# EAGLE design charliewatch-0402 (EAGLE 7.7.0)
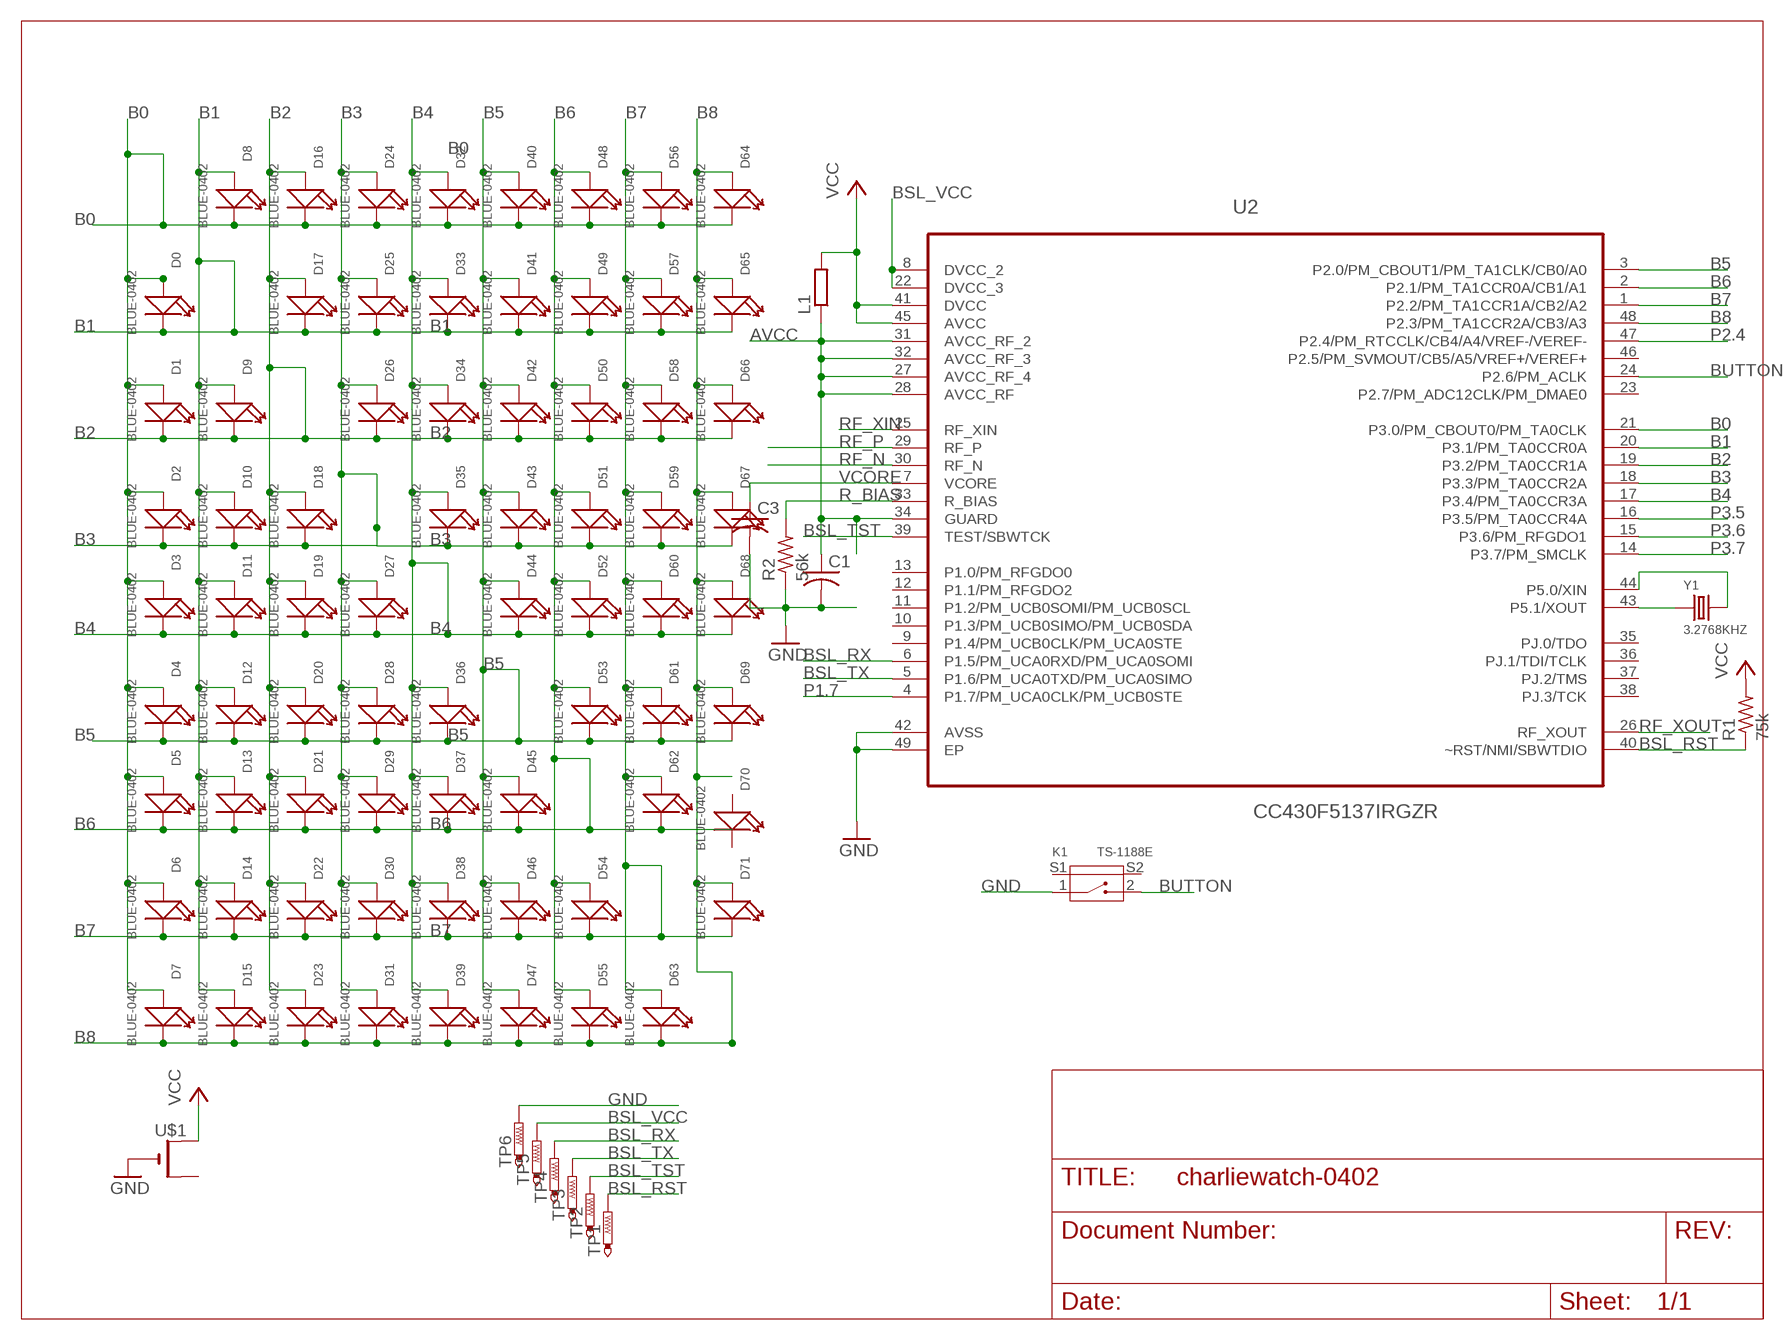
[diagram p0: schematic, sheet 1]

## Parts
C1  C-USC0402  [C0402]
C3  C-USC0402  [C0402]
D0  BLUE-0402  SMD-LED-CLEAR-BLUE(0402)  [LED-0402]
D1  BLUE-0402  SMD-LED-CLEAR-BLUE(0402)  [LED-0402]
D2  BLUE-0402  SMD-LED-CLEAR-BLUE(0402)  [LED-0402]
D3  BLUE-0402  SMD-LED-CLEAR-BLUE(0402)  [LED-0402]
D4  BLUE-0402  SMD-LED-CLEAR-BLUE(0402)  [LED-0402]
D5  BLUE-0402  SMD-LED-CLEAR-BLUE(0402)  [LED-0402]
D6  BLUE-0402  SMD-LED-CLEAR-BLUE(0402)  [LED-0402]
D7  BLUE-0402  SMD-LED-CLEAR-BLUE(0402)  [LED-0402]
D8  BLUE-0402  SMD-LED-CLEAR-BLUE(0402)  [LED-0402]
D9  BLUE-0402  SMD-LED-CLEAR-BLUE(0402)  [LED-0402]
D10  BLUE-0402  SMD-LED-CLEAR-BLUE(0402)  [LED-0402]
D11  BLUE-0402  SMD-LED-CLEAR-BLUE(0402)  [LED-0402]
D12  BLUE-0402  SMD-LED-CLEAR-BLUE(0402)  [LED-0402]
D13  BLUE-0402  SMD-LED-CLEAR-BLUE(0402)  [LED-0402]
D14  BLUE-0402  SMD-LED-CLEAR-BLUE(0402)  [LED-0402]
D15  BLUE-0402  SMD-LED-CLEAR-BLUE(0402)  [LED-0402]
D16  BLUE-0402  SMD-LED-CLEAR-BLUE(0402)  [LED-0402]
D17  BLUE-0402  SMD-LED-CLEAR-BLUE(0402)  [LED-0402]
D18  BLUE-0402  SMD-LED-CLEAR-BLUE(0402)  [LED-0402]
D19  BLUE-0402  SMD-LED-CLEAR-BLUE(0402)  [LED-0402]
D20  BLUE-0402  SMD-LED-CLEAR-BLUE(0402)  [LED-0402]
D21  BLUE-0402  SMD-LED-CLEAR-BLUE(0402)  [LED-0402]
D22  BLUE-0402  SMD-LED-CLEAR-BLUE(0402)  [LED-0402]
D23  BLUE-0402  SMD-LED-CLEAR-BLUE(0402)  [LED-0402]
D24  BLUE-0402  SMD-LED-CLEAR-BLUE(0402)  [LED-0402]
D25  BLUE-0402  SMD-LED-CLEAR-BLUE(0402)  [LED-0402]
D26  BLUE-0402  SMD-LED-CLEAR-BLUE(0402)  [LED-0402]
D27  BLUE-0402  SMD-LED-CLEAR-BLUE(0402)  [LED-0402]
D28  BLUE-0402  SMD-LED-CLEAR-BLUE(0402)  [LED-0402]
D29  BLUE-0402  SMD-LED-CLEAR-BLUE(0402)  [LED-0402]
D30  BLUE-0402  SMD-LED-CLEAR-BLUE(0402)  [LED-0402]
D31  BLUE-0402  SMD-LED-CLEAR-BLUE(0402)  [LED-0402]
D32  BLUE-0402  SMD-LED-CLEAR-BLUE(0402)  [LED-0402]
D33  BLUE-0402  SMD-LED-CLEAR-BLUE(0402)  [LED-0402]
D34  BLUE-0402  SMD-LED-CLEAR-BLUE(0402)  [LED-0402]
D35  BLUE-0402  SMD-LED-CLEAR-BLUE(0402)  [LED-0402]
D36  BLUE-0402  SMD-LED-CLEAR-BLUE(0402)  [LED-0402]
D37  BLUE-0402  SMD-LED-CLEAR-BLUE(0402)  [LED-0402]
D38  BLUE-0402  SMD-LED-CLEAR-BLUE(0402)  [LED-0402]
D39  BLUE-0402  SMD-LED-CLEAR-BLUE(0402)  [LED-0402]
D40  BLUE-0402  SMD-LED-CLEAR-BLUE(0402)  [LED-0402]
D41  BLUE-0402  SMD-LED-CLEAR-BLUE(0402)  [LED-0402]
D42  BLUE-0402  SMD-LED-CLEAR-BLUE(0402)  [LED-0402]
D43  BLUE-0402  SMD-LED-CLEAR-BLUE(0402)  [LED-0402]
D44  BLUE-0402  SMD-LED-CLEAR-BLUE(0402)  [LED-0402]
D45  BLUE-0402  SMD-LED-CLEAR-BLUE(0402)  [LED-0402]
D46  BLUE-0402  SMD-LED-CLEAR-BLUE(0402)  [LED-0402]
D47  BLUE-0402  SMD-LED-CLEAR-BLUE(0402)  [LED-0402]
D48  BLUE-0402  SMD-LED-CLEAR-BLUE(0402)  [LED-0402]
D49  BLUE-0402  SMD-LED-CLEAR-BLUE(0402)  [LED-0402]
D50  BLUE-0402  SMD-LED-CLEAR-BLUE(0402)  [LED-0402]
D51  BLUE-0402  SMD-LED-CLEAR-BLUE(0402)  [LED-0402]
D52  BLUE-0402  SMD-LED-CLEAR-BLUE(0402)  [LED-0402]
D53  BLUE-0402  SMD-LED-CLEAR-BLUE(0402)  [LED-0402]
D54  BLUE-0402  SMD-LED-CLEAR-BLUE(0402)  [LED-0402]
D55  BLUE-0402  SMD-LED-CLEAR-BLUE(0402)  [LED-0402]
D56  BLUE-0402  SMD-LED-CLEAR-BLUE(0402)  [LED-0402]
D57  BLUE-0402  SMD-LED-CLEAR-BLUE(0402)  [LED-0402]
D58  BLUE-0402  SMD-LED-CLEAR-BLUE(0402)  [LED-0402]
D59  BLUE-0402  SMD-LED-CLEAR-BLUE(0402)  [LED-0402]
D60  BLUE-0402  SMD-LED-CLEAR-BLUE(0402)  [LED-0402]
D61  BLUE-0402  SMD-LED-CLEAR-BLUE(0402)  [LED-0402]
D62  BLUE-0402  SMD-LED-CLEAR-BLUE(0402)  [LED-0402]
D63  BLUE-0402  SMD-LED-CLEAR-BLUE(0402)  [LED-0402]
D64  BLUE-0402  SMD-LED-CLEAR-BLUE(0402)  [LED-0402]
D65  BLUE-0402  SMD-LED-CLEAR-BLUE(0402)  [LED-0402]
D66  BLUE-0402  SMD-LED-CLEAR-BLUE(0402)  [LED-0402]
D67  BLUE-0402  SMD-LED-CLEAR-BLUE(0402)  [LED-0402]
D68  BLUE-0402  SMD-LED-CLEAR-BLUE(0402)  [LED-0402]
D69  BLUE-0402  SMD-LED-CLEAR-BLUE(0402)  [LED-0402]
D70  BLUE-0402  SMD-LED-CLEAR-BLUE(0402)  [LED-0402]
D71  BLUE-0402  SMD-LED-CLEAR-BLUE(0402)  [LED-0402]
K1  TS-1188E  SMD-BUTTON(2+2P-7X3.5MM-90D)  [SW4-SMD-7.0X3.5X3.5MM-90D]
L1  R-EU_R0603  [R0603]
R1  75k  R-US_R0402  [R0402]
R2  56k  R-US_R0402  [R0402]
TP1  PTR1TP10R  [TP10R]
TP2  PTR1TP10R  [TP10R]
TP3  PTR1TP10R  [TP10R]
TP4  PTR1TP10R  [TP10R]
TP5  PTR1TP10R  [TP10R]
TP6  PTR1TP10SQ  [TP10SQ]
U2  CC430F5137IRGZR  [QFN50P700X700X100-49N]
U$1  CR2032SMT  [CR2032-SMD]
Y1  3.2768KHZ  SMD-CRYSTAL-32.768KHZ-12.5PF-20PPM-90K(2P-L2.0X1.2MM)  [X2-SMD-L2.0X1.2X0.55MM]

## Nets
AVCC: C1.1 L1.1 U2.27(AVCC_RF_4) U2.28(AVCC_RF) U2.31(AVCC_RF_2) U2.32(AVCC_RF_3) U2.34(GUARD)
B0: D0.+ D1.+ D2.+ D3.+ D4.+ D5.+ D6.+ D7.+ D8.- D16.- D24.- D32.- D40.- D48.- D56.- D64.- U2.21(P3.0/PM_CBOUT0/PM_TA0CLK)
B1: D0.- D8.+ D9.+ D10.+ D11.+ D12.+ D13.+ D14.+ D15.+ D17.- D25.- D33.- D41.- D49.- D57.- D65.- U2.20(P3.1/PM_TA0CCR0A)
B2: D1.- D9.- D16.+ D17.+ D18.+ D19.+ D20.+ D21.+ D22.+ D23.+ D26.- D34.- D42.- D50.- D58.- D66.- U2.19(P3.2/PM_TA0CCR1A)
B3: D2.- D10.- D18.- D24.+ D25.+ D26.+ D27.+ D28.+ D29.+ D30.+ D31.+ D35.- D43.- D51.- D59.- D67.- U2.18(P3.3/PM_TA0CCR2A)
B4: D3.- D11.- D19.- D27.- D32.+ D33.+ D34.+ D35.+ D36.+ D37.+ D38.+ D39.+ D44.- D52.- D60.- D68.- U2.17(P3.4/PM_TA0CCR3A)
B5: D4.- D12.- D20.- D28.- D36.- D40.+ D41.+ D42.+ D43.+ D44.+ D45.+ D46.+ D47.+ D53.- D61.- D69.- U2.3(P2.0/PM_CBOUT1/PM_TA1CLK/CB0/A0)
B6: D5.- D13.- D21.- D29.- D37.- D45.- D48.+ D49.+ D50.+ D51.+ D52.+ D53.+ D54.+ D55.+ D62.- U2.2(P2.1/PM_TA1CCR0A/CB1/A1)
B7: D6.- D14.- D22.- D30.- D38.- D46.- D54.- D56.+ D57.+ D58.+ D59.+ D60.+ D61.+ D62.+ D63.+ D71.- U2.1(P2.2/PM_TA1CCR1A/CB2/A2)
B8: D7.- D15.- D23.- D31.- D39.- D47.- D55.- D63.- D64.+ D65.+ D66.+ D67.+ D68.+ D69.+ D71.+ U2.48(P2.3/PM_TA1CCR2A/CB3/A3)
BSL_RST: R1.1 TP1.TP U2.40(~RST/NMI/SBWTDIO)
BSL_RX: TP4.TP U2.6(P1.5/PM_UCA0RXD/PM_UCA0SOMI)
BSL_TST: TP2.TP U2.39(TEST/SBWTCK)
BSL_TX: TP3.TP U2.5(P1.6/PM_UCA0TXD/PM_UCA0SIMO)
BSL_VCC: TP5.TP U2.8(DVCC_2) U2.22(DVCC_3)
BUTTON: K1.2 U2.24(P2.6/PM_ACLK)
GND: C1.2 C3.2 K1.1 R2.1 TP6.TP U2.42(AVSS) U2.49(EP) U$1.-
P1.7: U2.4(P1.7/PM_UCA0CLK/PM_UCB0STE)
P2.4: U2.47(P2.4/PM_RTCCLK/CB4/A4/VREF-/VEREF-)
P3.5: U2.16(P3.5/PM_TA0CCR4A)
P3.6: U2.15(P3.6/PM_RFGDO1)
P3.7: U2.14(P3.7/PM_SMCLK)
R_BIAS: R2.2 U2.33(R_BIAS)
RF_N: U2.30(RF_N)
RF_P: U2.29(RF_P)
RF_XIN: U2.25(RF_XIN)
RF_XOUT: U2.26(RF_XOUT)
VCC: L1.2 R1.2 U2.41(DVCC) U2.45(AVCC) U$1.+$1(+)
VCORE: C3.1 U2.7(VCORE)
XIN: U2.44(P5.0/XIN) Y1.2
XOUT: U2.43(P5.1/XOUT) Y1.1
Unconnected: D70.+ D70.- K1.S1 K1.S2 U2.9(P1.4/PM_UCB0CLK/PM_UCA0STE) U2.10(P1.3/PM_UCB0SIMO/PM_UCB0SDA) U2.11(P1.2/PM_UCB0SOMI/PM_UCB0SCL) U2.12(P1.1/PM_RFGDO2) U2.13(P1.0/PM_RFGDO0) U2.23(P2.7/PM_ADC12CLK/PM_DMAE0) U2.35(PJ.0/TDO) U2.36(PJ.1/TDI/TCLK) U2.37(PJ.2/TMS) U2.38(PJ.3/TCK) U2.46(P2.5/PM_SVMOUT/CB5/A5/VREF+/VEREF+) U$1.+$2(+1)

## Library data of the parts
C1 C3 = resistor:C-US: CAPACITOR, American symbol
D0 D1-D71 = Seeed-LED:SMD-LED-CLEAR-BLUE(0402): 304090075; MPN: BL-HB337A-AV-TRB
K1 = Seeed-Switch:SMD-BUTTON(2+2P-7X3.5MM-90D): 311020023; MPN: TS-1188E
L1 = rcl:R-EU_: RESISTOR, European symbol
R1 R2 = rcl:R-US_: RESISTOR, American symbol
TP1-TP6 = testpad:PTR1: TEST PIN
U2 = Texas Instruments_By_element14_Batch_1:CC430F5137IRGZR: MSP430 SoC with RF Core; MPN: CC430F5137IRGZR; OC_FARNELL: -; OC_NEWARK: 68R5912; PACKAGE: QFN-48; SUPPLIER: TEXAS INSTRUMENTS
U$1 = adafruit:CR2032
Y1 = Seeed-Crystal Oscillator:SMD-CRYSTAL-32.768KHZ-12.5PF-20PPM-90K(2P-L2.0X1.2MM): 306010020; MPN: FC-12M

## Net classes
0 default: width 0.102 mm, drill 0.025 mm, clearance 0.025 mm

## Board
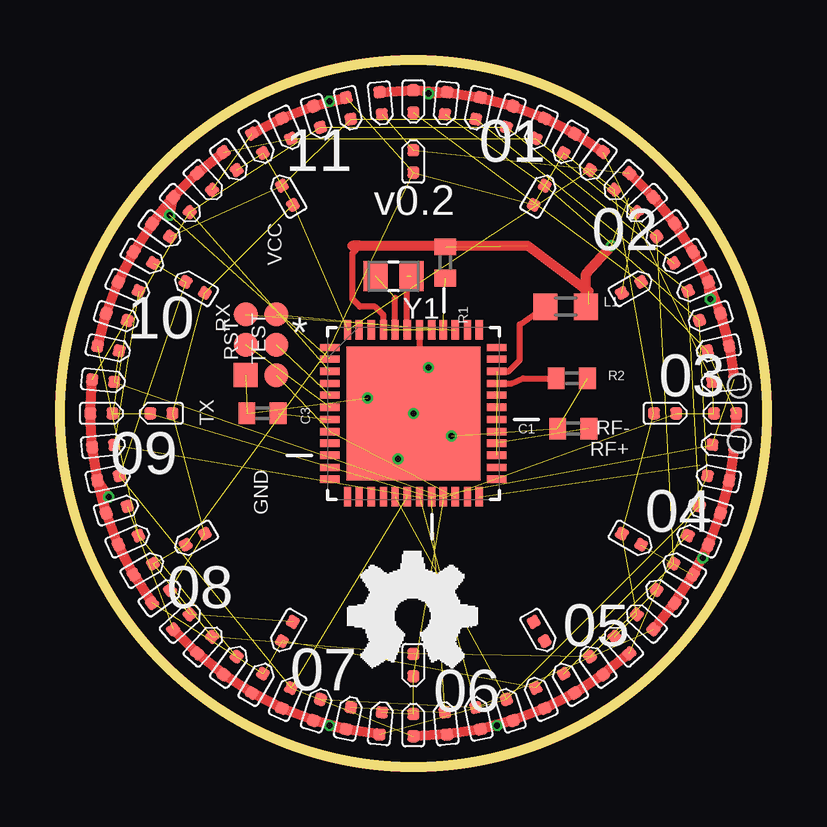
[diagram p1: board, top side]
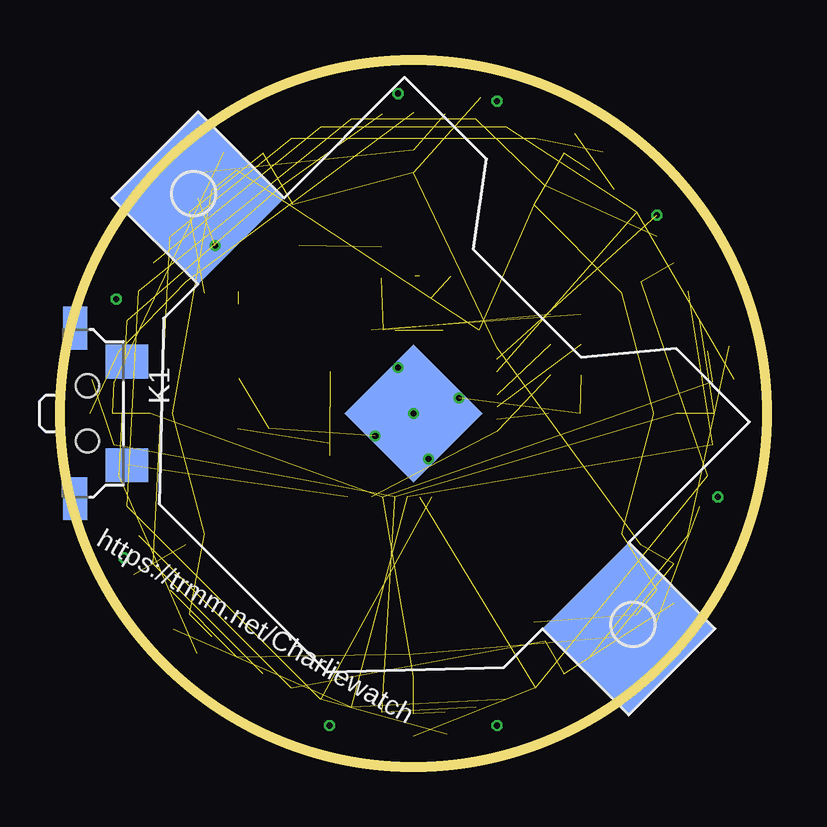
[diagram p2: board, bottom side, seen from below]

Size 29.46 x 29.46 mm. Coordinates in mm from the lower left corner, seen from the top.
Outline: circle at 14.73,14.73 radius 14.73
Copper layers (1*16): Top 0.035mm / dielectric 1.5mm / Bottom 0.035mm
Design rules "default *": minimum track width 10mil, minimum drill 10mil, track to track 5mil, track to pad 5mil, pad to pad 5mil, via to via 5mil, smd to smd 5mil, copper to edge 40mil, drill to drill 8mil, minimum pad ring 10mil, minimum via ring 4mil, stop-mask expansion 4mil, vias tented up to drill 15mil, thermal gap 10mil

### Footprints (pad centres in the part's own frame; a part is rotated, then mirrored left to right if it is on the bottom)
C0402 = smd 0.7 x 0.9: 1 -0.65,0; 2 0.65,0
LED-0402 = smd 0.5 x 0.5: + -0.463,0; - 0.463,0
SW4-SMD-7.0X3.5X3.5MM-90D = smd 1.397 x 1.778: 1 -2.159,1.651; 2 2.159,1.651 | smd 1.778 x 1.016: S1 -3.556,-0.508; S2 3.556,-0.508 | hole 0.95: -1.15,0; 1.15,0
R0603 = smd 1 x 1.1: 1 -0.85,0; 2 0.85,0
R0402 = smd 0.7 x 0.9: 1 -0.65,0; 2 0.65,0
TP10R = smd 1 x 1: TP 0,0
TP10SQ = smd 1 x 1: TP 0,0
QFN50P700X700X100-49N = smd 0.813 x 0.305: 1 -3.48,2.743; 2 -3.48,2.261; 3 -3.48,1.753; 4 -3.48,1.245; 5 -3.48,0.762; 6 -3.48,0.254; 7 -3.48,-0.254; 8 -3.48,-0.762; 9 -3.48,-1.245; 10 -3.48,-1.753; 11 -3.48,-2.261; 12 -3.48,-2.743; 25 3.48,-2.743; 26 3.48,-2.261; 27 3.48,-1.753; 28 3.48,-1.245; 29 3.48,-0.762; 30 3.48,-0.254; 31 3.48,0.254; 32 3.48,0.762; 33 3.48,1.245; 34 3.48,1.753; 35 3.48,2.261; 36 3.48,2.743 | smd 0.305 x 0.813: 13 -2.743,-3.48; 14 -2.261,-3.48; 15 -1.753,-3.48; 16 -1.245,-3.48; 17 -0.762,-3.48; 18 -0.254,-3.48; 19 0.254,-3.48; 20 0.762,-3.48; 21 1.245,-3.48; 22 1.753,-3.48; 23 2.261,-3.48; 24 2.743,-3.48; 37 2.743,3.48; 38 2.261,3.48; 39 1.753,3.48; 40 1.245,3.48; 41 0.762,3.48; 42 0.254,3.48; 43 -0.254,3.48; 44 -0.762,3.48; 45 -1.245,3.48; 46 -1.753,3.48; 47 -2.261,3.48; 48 -2.743,3.48 | smd 5.588 x 5.588: 49 0,0
CR2032-SMD = smd 5.08 x 5.08: +$1 -12.7,0; +$2 12.7,0 | smd 4.064 x 4.064: - 0,0
X2-SMD-L2.0X1.2X0.55MM = smd 1 x 1.25: 1 -0.75,0; 2 0.75,0

### Placement (x,y rotation side)
C1  21.4,14.1 180 top
C3  8.45,14.73 180 top
D0  13.37,27.66 276 top
D1  14.73,27.73 270 top
D2  16.09,27.66 264 top
D3  17.43,27.45 258 top
D4  18.75,27.1 252 top
D5  20.02,26.61 246 top
D6  21.23,25.99 240 top
D7  22.37,25.25 234 top
D8  27.66,16.09 186 top
D9  27.45,17.43 192 top
D10  27.1,18.75 198 top
D11  26.61,20.02 204 top
D12  25.99,21.23 210 top
D13  25.25,22.37 216 top
D14  24.39,23.43 222 top
D15  23.43,24.39 228 top
D16  27.73,14.73 180 top
D17  27.66,13.37 174 top
D18  27.45,12.03 168 top
D19  27.1,10.71 162 top
D20  26.61,9.44 156 top
D21  25.99,8.23 150 top
D22  25.25,7.09 144 top
D23  24.39,6.03 138 top
D24  14.73,1.73 90 top
D25  16.09,1.8 96 top
D26  17.43,2.02 102 top
D27  18.75,2.37 108 top
D28  20.02,2.85 114 top
D29  21.23,3.47 120 top
D30  22.37,4.21 126 top
D31  23.43,5.07 132 top
D32  13.37,1.8 84 top
D33  12.03,2.02 78 top
D34  10.71,2.37 72 top
D35  9.44,2.85 66 top
D36  8.23,3.47 60 top
D37  7.09,4.21 54 top
D38  6.03,5.07 48 top
D39  5.07,6.03 42 top
D40  1.8,16.09 354 top
D41  1.73,14.73 0 top
D42  1.8,13.37 6 top
D43  2.02,12.03 12 top
D44  2.37,10.71 18 top
D45  2.85,9.44 24 top
D46  3.47,8.23 30 top
D47  4.21,7.09 36 top
D48  2.02,17.43 348 top
D49  2.37,18.75 342 top
D50  2.85,20.02 336 top
D51  3.47,21.23 330 top
D52  4.21,22.37 324 top
D53  5.07,23.43 318 top
D54  6.03,24.39 312 top
D55  7.09,25.25 306 top
D56  14.73,4.23 270 top
D57  14.73,25.23 90 top
D58  23.83,19.98 30 top
D59  19.98,23.83 60 top
D60  12.03,27.45 282 top
D61  10.71,27.1 288 top
D62  9.44,26.61 294 top
D63  8.23,25.99 300 top
D64  25.23,14.73 0 top
D65  4.23,14.73 180 top
D66  23.83,9.48 330 top
D67  5.64,19.98 150 top
D68  9.48,23.83 120 top
D69  9.48,5.64 240 top
D70  19.98,5.64 300 top
D71  5.64,9.48 210 top
K1  28.32,14.73 270 bottom
L1  21.08,19.18 0 top
R1  16.07,21.02 90 top
R2  21.34,16.19 180 top
TP1  9.02,18.86 180 top
TP2  7.75,18.86 180 top
TP3  9.02,17.59 180 top
TP4  7.75,17.59 180 top
TP5  9.02,16.32 180 top
TP6  7.75,16.32 180 top
U2  14.73,14.73 0 top
U$1  14.73,14.73 315 bottom
Y1  13.91,20.45 180 top

### Tracks (layer width: path | path; a pad name or v marks a point on that pad's centre or on a via)
AVCC  (5 unrouted)
  Top 0.254: U2.34 18.71,16.48 19.18,16.95 19.18,18.44 L1.1
B0  (via drill 0.25)  (9 unrouted)
  Top 0.254: U2.21 16,11.23
  Top 0.406: D0.+ D1.+ D2.+ | D2.+ D3.+ D4.+ D5.+ D6.+ D7.+ | v15.37,28.07 D2.+
B1  (via drill 0.25)  (9 unrouted)
  Top 0.406: D15.+ D14.+ D13.+ D12.+ D11.+ | D11.+ D10.+ D9.+ D8.+ | v27.11,19.5 D11.+
B2  (via drill 0.25)  (9 unrouted)
  Top 0.406: D16.+ D17.+ D18.+ D19.+ D20.+ | D20.+ D21.+ D22.+ D23.+ | v26.8,8.7 D20.+
B3  (via drill 0.25)  (9 unrouted)
  Top 0.406: D31.+ D30.+ D29.+ D28.+ D27.+ D26.+ | D26.+ D25.+ D24.+ | v18.22,1.71 D26.+
B4  (via drill 0.25)  (9 unrouted)
  Top 0.406: D32.+ D33.+ | D33.+ D34.+ D35.+ D36.+ D37.+ D38.+ D39.+ | v11.24,1.71 D33.+
B5  (via drill 0.25)  (9 unrouted)
  Top 0.406: D47.+ D46.+ D45.+ D44.+ D43.+ | D43.+ D42.+ D41.+ D40.+ | v2.03,11.24 D43.+
B6  (via drill 0.25)  (8 unrouted)
  Top 0.406: D48.+ D49.+ D50.+ D51.+ D52.+ D53.+ | D53.+ D54.+ D55.+ | v4.57,22.99 D53.+
B7  (via drill 0.25)  (13 unrouted)
  Top 0.406: D63.+ D62.+ D61.+ D60.+ v11.24,27.75
B8  (15 unrouted)
BSL_RST  (2 unrouted)
BSL_RX  (1 unrouted)
BSL_TST  (1 unrouted)
BSL_TX  (1 unrouted)
BSL_VCC  (2 unrouted)
BUTTON  (1 unrouted)
GND  (via drill 0.25)  (4 unrouted)
  Top 0.254: U2.42 14.99,16.7 U$1.- | v12.83,15.37 U$1.- | v14.1,12.83 U$1.- | v15.37,16.64 U$1.- | v16.32,13.78 U$1.-
  Top 0.61: U$1.- 12.83,12.83 12.83,12.51
  other vias: 14.73,14.73
R_BIAS
  Top 0.254: U2.33 18.83,15.98 19.3,16.19 R2.2
VCC  (via drill 0.25)  (4 unrouted)
  Top 0.254: U2.45 13.49,18.83 13.14,19.18 12.51,19.18 12.19,19.5 12.19,21.4 12.51,21.72 | 22.04,19.28 L1.2
  Top 0.406: 12.19,21.72 12.51,21.72 19.5,21.72 22.04,19.81 | L1.2 21.93,20.55 v22.99,21.72
VCORE  (1 unrouted)
XIN  (1 unrouted)
  Top 0.254: U2.44 13.97,19.56
XOUT  (1 unrouted)
  Top 0.254: U2.43 14.48,20.45

### Text on the board
tNames: 01 | 11 | v0.2 | VCC | 02 | RX | 10 | RST | TEST | 03 | TX | RF- | RF+ | 09 | GND | 04 | 08 | 05 | 07 | 06
bNames: https://trmm.net/Charliewatch